# Altium schematic sheet dcshift_digital.SchDoc: Digital DC Shift
size A4; Organization: Altium Limited; Address1: L3, 12a Rodborough Rd; Address2: Frenchs Forest; Address3: NSW; Address4: Australia 2086
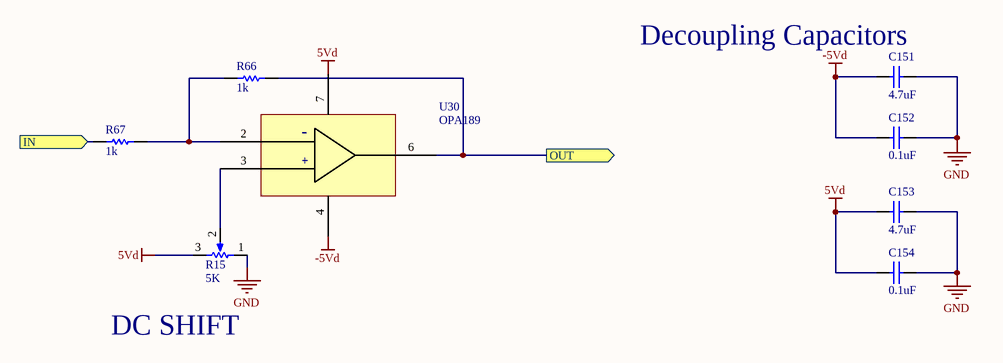
[diagram p0: dcshift_digital.SchDoc]

## Parts
C151  4.7uF  [0402_Cap]
C152  0.1uF  [0402_Cap]
C153  4.7uF  [0402_Cap]
C154  0.1uF  [0402_Cap]
R15  5K  [TRIMPOT]
R66  1k  [0402_Res]
R67  1k  [0402_Res]
U30  OPA189  [SOIC_8]

## Ports
IN (in), OUT (out)

## Nets
5Vd: C153.1 C154.1 R15.3(BOT) U30.7
-5Vd: C151.1 C152.1 U30.4
GND: C151.2 C152.2 C153.2 C154.2 R15.1(TOP)
IN: R67.1 ; port IN
OUT: R66.2 U30.6 ; port OUT
NetR15_2: R15.2(TAP) U30.3
NetR66_1: R66.1 R67.2 U30.2

## Notes on the sheet
- (near C151) Decoupling Capacitors
- DC SHIFT
- Title
- Date:
- RE:
- Arturo di Girolamo
- Size:
- A3
- A
- (in symbol OPA189IDR) -; +

## Library data of the parts
C151 C153 = CL21A475KAQNNNE: Capacitor, 4.7uF, 0805; Value: .01uf; ASYPN: GRM155R61A475MEAAD; MFGPN: CL21A475KAQNNNE
C152 C154 = CL21B104KACNNNC: Capacitor, 0.1uF, 0805; Value: .01uf; ASYPN: 0402YC104KAT2A; MFGPN: CL21B104KACNNNC
R15 = PV36W102C01B00: Potentiometer, 1k; MFGPN: PV36W102C01B00
R66 R67 = RNCP0805FTD1K00: 1K 1% 1/4W; ASYPN: RMCF0402FT1K00; Value: 1K; MFGPN: RNCP0805FTD1K00
U30 = OPA189IDR: Precision OpAmp, Generic; MFGPN: OPA189IDR; ASYPN: OPA189ID